# EAGLE design TaaraESP-THBL (EAGLE 7.7.0)
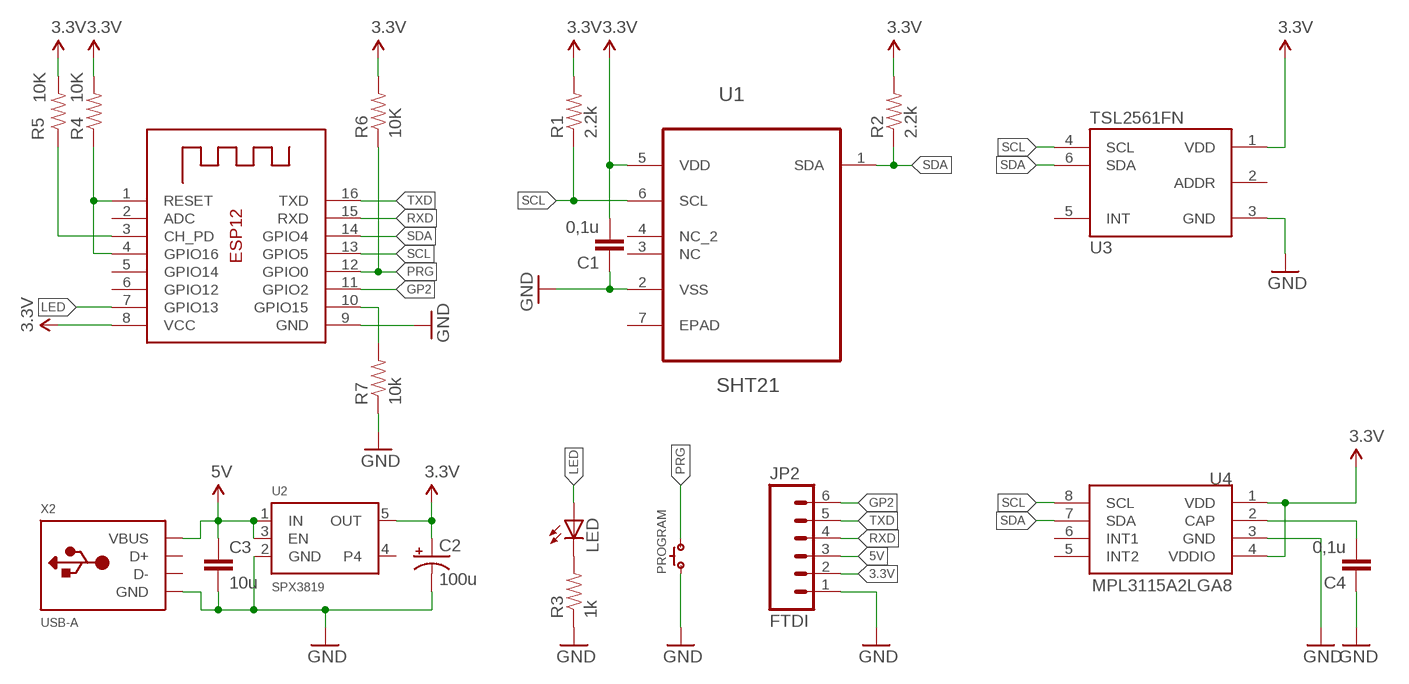
[diagram p0: schematic, sheet 1]

## Parts
C1  0,1u  CAP0603-CAP  [0603-CAP]
C2  100u  CAP_POL1206  [EIA3216]
C3  10u  CAP0603-CAP  [0603-CAP]
C4  0,1u  CAP0603-CAP  [0603-CAP]
JP2  FTDI  M06SIP_LOCK  [1X06-SIP_LOCK]
LED  LEDCHIPLED_0603  [CHIPLED_0603]
PROGRAM  SPST.B3U-1000P(M)-B  [B3U-1000P(M)-B]
R1  2.2k  RESISTOR0603-RES  [0603-RES]
R2  2.2k  RESISTOR0603-RES  [0603-RES]
R3  1k  RESISTOR0603-RES  [0603-RES]
R4  10K  RESISTOR0603-RES  [0603-RES]
R5  10K  RESISTOR0603-RES  [0603-RES]
R6  10K  RESISTOR0603-RES  [0603-RES]
R7  10k  RESISTOR0603-RES  [0603-RES]
U1  SHT21  [DFN300X300X110-7N]
U2  SPX3819  VREG_SOT23-5  [SOT23-5]
U3  TSL2561FN  [FN-6]
U4  MPL3115A2LGA8  [LGA8]
X1  ESP-12  [ESP-12]
X2  USB-A  [MOLEX_480371000]

## Nets
3.3V: C1.2 C2.A(+) JP2.2 R1.2 R2.2 R4.2 R5.2 R6.2 U1.5(VDD) U2.5(OUT) U3.1(VDD) U4.1(VDD) U4.4(VDDIO) X1.8(VCC)
5V: C3.1 JP2.3 U2.1(IN) U2.3(EN) X2.1(VBUS)
GND: C1.1 C2.C(-) C3.2 C4.1 JP2.1 PROGRAM.1 R3.1 R7.1 U1.2(VSS) U2.2(GND) U3.3(GND) U4.3(GND) X1.9(GND) X2.4(GND)
GP2: JP2.6 X1.11(GPIO2)
LED: LED.A X1.7(GPIO13)
N$1: LED.C R3.2
N$2: R4.1 X1.1(RESET) X1.4(GPIO16)
N$3: R5.1 X1.3(CH_PD)
N$4: R7.2 X1.10(GPIO15)
N$5: C4.2 U4.2(CAP)
PRG: PROGRAM.2 R6.1 X1.12(GPIO0)
RXD: JP2.4 X1.15(RXD)
SCL: R1.1 U1.6(SCL) U3.4(SCL) U4.8(SCL) X1.13(GPIO5)
SDA: R2.1 U1.1(SDA) U3.6(SDA) U4.7(SDA) X1.14(GPIO4)
TXD: JP2.5 X1.16(TXD)
Unconnected: U1.3(NC) U1.4(NC_2) U1.7(EPAD) U2.4 U3.2(ADDR) U3.5(INT) U4.5(INT2) U4.6(INT1) X1.2(ADC) X1.5(GPIO14) X1.6(GPIO12) X2.2(D-) X2.3(D+)

## Library data of the parts
C1 C3 C4 = SparkFun:CAP: Capacitor Standard 0603 ceramic capacitor, and 0.1" leaded capacitor.
C2 = SparkFun:CAP_POL: Capacitor Polarized These are standard SMD and PTH capacitors. Normally 10uF, 47uF, and 100uF in electrolytic and tantalum varieties. Always verify the external diameter of the through hole cap, it varies with capacity, voltage, and manufacturer. The EIA devices should be standard.
JP2 = SparkFun:M06: Header 6 Standard 6-pin 0.1" header. Use with straight break away headers (SKU : PRT-00116), right angle break away headers (PRT-00553), swiss pins (PRT-00743), machine pins (PRT-00117), and female headers (PRT-00115). Molex polarized connector foot print use with SKU : PRT-08094 with associated crimp pins and housings. NOTES ON THE VARIANTS LOCK and LOCK_LONGPADS... This footprint was designed to help hold the alignment of a through-hole component (i.e. 6-pin header) while soldering it into place. You may notice that each hole has been shifted either up or down by 0.005 of an inch from it's more standard position (which is a perfectly straight line). This slight alteration caused the pins (the squares in the middle) to touch the edges of the holes. Because they are alternating, it causes a "brace" to hold the component in place. 0.005 has proven to be the perfect amount of "off-center" position when using our standard breakaway headers. Although looks a little odd when you look at the bare footprint, once you have a header in there, the alteration is very hard to notice. Also, if you push a header all the way into place, it is covered up entirely on the bottom side. This idea of altering the position of holes to aid alignment will be further integrated into the Sparkfun Library for other footprints. It can help hold any component with 3 or more connection pins.
LED = adafruit:LED: LED OSRAM: - CHIPLED LG R971, LG N971, LY N971, LG Q971, LY Q971, LO R971, LY R971 LH N974, LH R974 LS Q976, LO Q976, LY Q976 LO Q996 - Hyper CHIPLED LW Q18S LB Q993, LB Q99A, LB R99A - SideLED LS A670, LO A670, LY A670, LG A670, LP A670 LB A673, LV A673, LT A673, LW A673 LH A674 LY A675 LS A676, LA A676, LO A676, LY A676, LW A676 LS A679, LY A679, LG A679 - Hyper Micro SIDELED® LS Y876, LA Y876, LO Y876, LY Y876 LT Y87S - SmartLED LW L88C, LW L88S LB L89C, LB L89S, LG L890 LS L89K, LO L89K, LY L89K LS L896, LA L896, LO L896, LY L896 - TOPLED LS T670, LO T670, LY T670, LG T670, LP T670 LSG T670, LSP T670, LSY T670, LOP T670, LYG T670 LG T671, LOG T671, LSG T671 LB T673, LV T673, LT T673, LW T673 LH T674 LS T676, LA T676, LO T676, LY T676, LB T676, LH T676, LSB T676, LW T676 LB T67C, LV T67C, LT T67C, LS T67K, LO T67K, LY T67K, LW E67C LS E67B, LA E67B, LO E67B, LY E67B, LB E67C, LV E67C, LT E67C LW T67C LS T679, LY T679, LG T679 LS T770, LO T770, LY T770, LG T770, LP T770 LB T773, LV T773, LT T773, LW T773 LH T774 LS E675, LA E675, LY E675, LS T675 LS T776, LA T776, LO T776, LY T776, LB T776 LHGB T686 LT T68C, LB T68C - Hyper Mini TOPLED® LB M676 - Mini TOPLED Santana® LG M470 LS M47K, LO M47K, LY M47K Source: http://www.osram.convergy.de/
PROGRAM = omron:SPST
R1-R7 = SparkFun:RESISTOR: Resistor Basic schematic elements and footprints for 0603, 1206, and PTH resistors.
U1 = Sensirion-SHT21:SHT21: SENSOR, HUMIDITY & TEMP; MPN: SHT21; OC_FARNELL: 1855468; OC_NEWARK: 20T1172; PACKAGE: DFN-6; SUPPLIER: SENSIRION
U2 = microbuilder:VREG_SOT23-5: SOT23-5 Fixed Voltage Regulators Part Current Out V Out V In V Dropout θJA (°C/W) TJ (°C) Digikey Part No. ADP121 150mA 3.3V 3.4-5.5V 0.09V @ 150mA -- -- ADP121-AUJZ33R7CT-ND ADP121 150mA 3.0V 3.1-5.5V 0.09V @ 150mA -- -- ADP121-AUJZ30R7CT-ND ADP122 300mA 3.3V 3.4-5.5V 0.085V @ 300mA -- -- ADP122AUJZ-3.3-R7CT-ND ADP1712 300mA 3.3V 3.5-5.5V 0.17V @ 300mA -- -- ADP1712AUJZ-3.3-R7TR-ND AP7311 (Low Cost) 150mA 3.3V 3.5-6V 0.15V @ 150mA -- -- AP7311-33WG-7DICT-ND LD39015M18R 150mA 1.8V 1.9V-5.5V 0.08V @ 100mA -- -- 497-6977-1-ND LP2985A-33DBVR 150mA 3.3V 3.3-16V 0.28V @ 150mA 206 150 296-18479-1-ND MCP1824T-3302E/OT 300mA 3.3V 3.5V-6V 0.2V @ 300mA -- -- MCP1824T-3302E/OTCT-ND MIC5205-2.5YM5 TR 150mA 2.5V 2.7-16V 0.165V @ 150mA -- -- 576-1257-2-ND MIC5205-3.0YM5 TR 150mA 3.0V 3.2V-16V 0.165V @ 150mA -- -- 576-1258-2-ND MIC5205-3.3YM5 TR 150mA 3.3V 3.5V-16V 0.165V @ 150mA -- -- 576-1259-2-ND TPS780330220 150mA 3.3V+2.2V 3.6-5.5V 250mV Max -- -- 296-23332-1-ND TDA3663/N1,135 100mA 3.3V 3.5-45V 0.18V @ 50mA -- -- 568-5343-1-ND Max operating temp can be calculated using θJA, TJ (max junction temperature), and power in watts. Set the "Maximum Ambient Temperature" until it reaches TJ ("Max Junction Temperature"), which is the absolute limit for safe use of the regulator: Heat Sink Temperature Calculator <http://www.daycounter.com/Calculators/Heat-Sink-Temperature-Calculator.phtml> For example, With 12V source into a 3.3V LP2985 and a 30mA load, we are dissipating (12V-3.3V) * 0.03A = 0.261W. With a θJA of 206 °C/W, a TJ of 150°C, and 261mW we can safely use the chip without a heat sink up to 75°C (=147.1°C Junction Temperature).
U3 = mike-temp:TSL2561: TSL2561 illumination sensor Approximates Human Eye Response Precisely Measures Illuminance Programmable Interrupt Function with User-Defined Upper and Lower Threshold 400 KHz I2C interface Programmable Analog Gain and Integration Time Supporting 1,000,000-to-1 Dynamic Range Automatically Rejects 50/60-Hz Lighting Ripple Low Active Power (0.75 mW Typical) with Power Down Mode RoHS Compliant The TSL2561 is a light-to-digital converter that transform light intensity to a digital signal output via I2C interface. The device combines one broadband photodiode (visible plus infrared) and one infrared-responding photodiode on a single CMOS integrated circuit capable of providing a near-photopic response over an effective 20-bit dynamic range (16-bit resolution). Two integrating ADCs convert the photodiode currents to a digital output that represents the irradiance measured on each channel. This digital output can be input to a microprocessor where illuminance (ambient light level) in lux is derived using an empirical formula to approximate the human eye response. The TSL2561 device supports a traditional level style interrupt that remains asserted until the firmware clears it.
U4 = SparkFun-Sensors:MPL3115A2: Altimeter/Pressure Sensor, I2C, 1.95V-3.6V supply, 50 to 110kPa
X1 = microbuilder:ESP-12
X2 = adafruit:USB-A: USB type A 'plug' Used for things that can directly connect to a USB port, say USB key

## Net classes
0 default: width 0.2 mm
1 power: width 0.2 mm

## Board
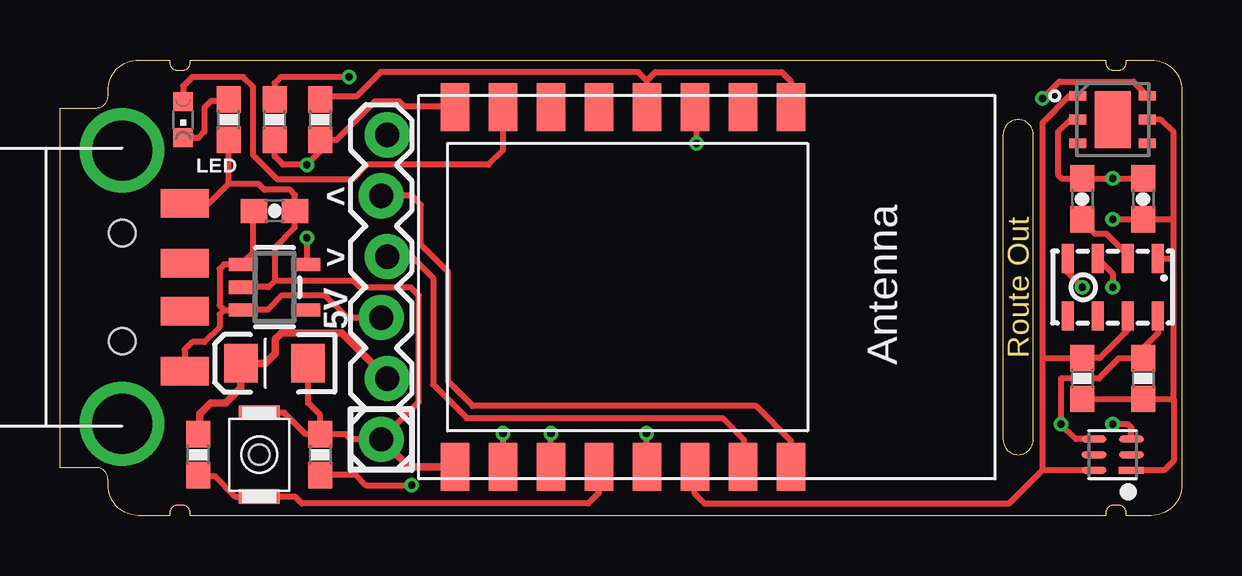
[diagram p1: board, top side]
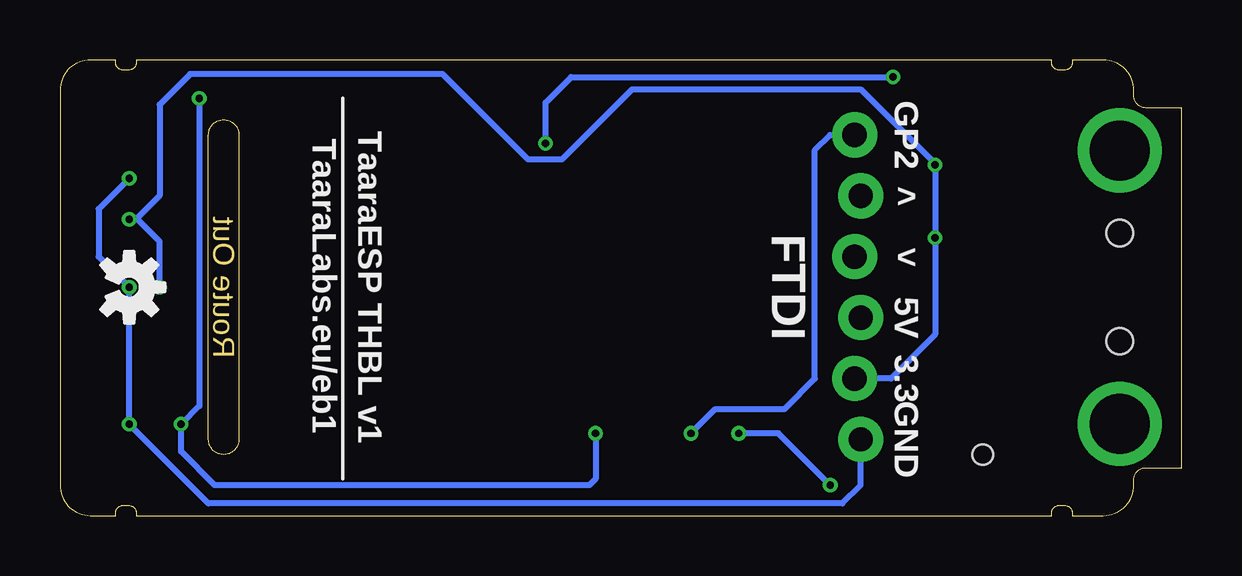
[diagram p2: board, bottom side, seen from below]

Size 46.75 x 19 mm. Coordinates in mm from the lower left corner, seen from the top.
Outline: 39.29,15.88 39.29,3.17 arc90 39.93,2.54 arc90 40.56,3.17 40.56,15.88 arc90 39.93,16.51 arc90 39.29,15.88
Outline: 4.57,0 3.27,0 arc-90 2,1.27 2,1.5 arc90 1.5,2 0,2 0,17 1.5,17 arc90 2,17.5 2,17.73 arc-90 3.27,19 4.57,19 4.57,18.89 arc90 4.89,18.57 5.11,18.57 arc90 5.43,18.89 5.43,19 43.57,19 43.57,18.89 arc90 43.89,18.57 44.11,18.57 arc90 44.43,18.89 44.43,19 45.48,19 arc-90 46.75,17.73 46.75,1.27 arc-90 45.48,0 44.43,0 44.43,0.11 arc90 44.11,0.43 43.89,0.43 arc90 43.57,0.11 43.57,0 5.43,0 5.43,0.11 arc90 5.11,0.43 4.89,0.43 arc90 4.57,0.11 4.57,0
Copper layers (1*16): Top 0.035mm / dielectric 1.5mm / Bottom 0.035mm
Design rules "default *": minimum track width 10mil, minimum drill 12mil, track to track 6mil, track to pad 6mil, pad to pad 6mil, via to via 6mil, smd to smd 0mil, copper to edge 10mil, drill to drill 10mil, minimum pad ring 10mil, minimum via ring 6mil, stop-mask expansion 2mil, vias tented up to drill 100mil, thermal gap 10mil

### Footprints (pad centres in the part's own frame; a part is rotated, then mirrored left to right if it is on the bottom)
0603-CAP = smd 1.1 x 1: 1 -0.85,0; 2 0.85,0
EIA3216 = smd 1.4 x 1.6: A 1.4,0; C -1.4,0
1X06-SIP_LOCK = drill 1.016 pad 1.88: 1 0,0; 2 2.54,-0.254; 3 5.08,0; 4 7.62,-0.254; 5 10.16,0; 6 12.7,-0.254
CHIPLED_0603 = smd 0.8 x 0.8: A 0,-0.75; C 0,0.75
B3U-1000P(M)-B = smd 0.6 x 1.7: 1 -1.75,0; 2 1.75,0 | hole 0.85: 0,0
0603-RES = smd 1.1 x 1: 1 -0.85,0; 2 0.85,0
DFN300X300X110-7N = smd 0.711 x 0.406: 1 -1.448,0.991; 2 -1.448,0; 3 -1.448,-0.991; 4 1.448,-0.991; 5 1.448,0; 6 1.448,0.991 | smd 1.499 x 2.388: 7 0,0
SOT23-5 = smd 0.55 x 1.2: 1 -0.95,-1.3; 2 0,-1.3; 3 0.95,-1.3; 4 0.95,1.3; 5 -0.95,1.3
FN-6 = smd 1.05 x 0.3: 1 -0.775,0.65; 2 -0.775,0; 3 -0.775,-0.65; 4 0.775,-0.65; 5 0.775,0; 6 0.775,0.65
LGA8 = smd 1.2 x 0.5: 1 -1.2,1.875; 2 -1.2,0.625; 3 -1.2,-0.625; 4 -1.2,-1.875; 5 1.2,-1.875; 6 1.2,-0.625; 7 1.2,0.625; 8 1.2,1.875
ESP-12 = smd 2 x 1.2: 1 -7.5,4.5; 2 -7.5,2.5; 3 -7.5,0.5; 4 -7.5,-1.5; 5 -7.5,-3.5; 6 -7.5,-5.5; 7 -7.5,-7.5; 8 -7.5,-9.5; 9 7.5,-9.5; 10 7.5,-7.5; 11 7.5,-5.5; 12 7.5,-3.5; 13 7.5,-1.5; 14 7.5,0.5; 15 7.5,2.5; 16 7.5,4.5
MOLEX_480371000 = smd 1.2 x 2: 1 3.5,2.6; 2 1,2.6; 3 -1,2.6; 4 -3.5,2.6 | drill 2.5: M1 -5.7,0; M2 5.7,0 | hole 1.1: -2.25,0; 2.25,0

### Placement (x,y rotation side)
C1  45.13,13.21 270 top
C2  8.94,6.35 180 top
C3  8.94,12.7 0 top
C4  42.59,13.21 270 top
JP2  13.38,3.17 90 top
LED  5.13,16.51 180 top
PROGRAM  8.3,2.54 270 top
R1  45.13,5.71 270 top
R2  42.59,5.71 270 top
R3  7.03,16.51 90 top
R4  10.84,16.51 270 top
R5  8.94,16.51 270 top
R6  5.76,2.54 90 top
R7  10.84,2.54 270 top
U1  43.86,16.51 0 top
U2  8.94,9.53 270 top
U3  43.86,2.54 180 top
U4  43.86,9.53 270 top
U$5  [OSHW-LOGO-S]  43.86,9.53 270 bottom
X1  25.96,9.53 270 top
X2  2.59,9.53 270 top

### Tracks (layer width: path | path; a pad name or v marks a point on that pad's centre or on a via)
3.3V  (via drill 0.3)
  Top 0.254: 10.69,15.85 R4.2 | v10.28,11.58 10.28,10.57 U2.5 | X1.8 16.43,17.07 14.35,17.07 14.14,17.27 13.13,17.27 11.52,15.66 R4.2 | 5.81,3.45 R6.2 | R4.2 10.84,15.19 v10.28,14.63 9.29,14.63 8.94,14.99 R5.2 | 45.67,10.79 U4.1 46.4,10.72 | 44.72,1.91 U3.1 46.01,1.89 46.4,2.29 46.4,4.87 | 46.4,4.87 R1.2 R2.2 | 46.4,4.87 46.4,10.72 | 46.4,10.72 46.4,12.36 | 46.4,12.36 46.4,16 45.89,16.51 U1.5 | 46.4,12.36 C1.2 v43.86,12.36 | U4.4 41.99,10.13 v42.59,9.53
  Top 0.305: 5.81,3.45 5.81,4.24 6.27,4.7 6.91,4.7 7.54,5.33 C2.A 8.56,6.35 8.98,6.77 8.98,7.37 9.23,7.62 11.73,7.62 JP2.2
  Bottom 0.254: JP2.2 12.11,5.71 10.28,7.54 v10.28,11.58 v10.28,14.63 10.28,14.68 13.38,17.78 22.91,17.78 25.83,14.86 27.25,14.86 30.81,18.41 41.32,18.41 42.59,17.14 42.59,13.34 43.57,12.36 v43.86,12.36 43.52,12.36 42.59,11.43 v42.59,9.53
5V
  Top 0.254: C3.1 8.05,12.6 8.05,10.97 7.64,10.57 U2.1 6.84,10.47 6.65,10.29 6.65,8.76 6.84,8.57 | 5,6.1 X2.1 5.19,6.92 5.51,7.24 6.02,7.24 6.65,7.87 6.65,8.39 6.84,8.57 | 7.64,8.53 U2.3 | JP2.3 11.96,8.26 11.02,9.2 9.27,9.2 8.65,8.57 U2.3 | 6.84,8.57 U2.3
GND  (via drill 0.3)
  Top 0.254: 7.03,15.44 R3.1 7.03,13.84 | 16.63,2.03 X1.9 16.43,2.03 | X2.4 6.22,13.03 7.03,13.84 | 7.03,13.84 8.26,13.84 8.52,13.59 9.57,13.59 9.79,13.37 C3.2 9.79,12.03 8.94,11.18 8.94,9.78 | R7.1 11.9,3.39 12.11,3.17 JP2.1 14.96,4.75 14.96,9.17 14.6,9.53 12.49,9.53 12.24,9.78 8.94,9.78 | R7.1 10.84,4.19 10.34,4.7 C2.C | R7.1 10.25,3.39 9.35,4.29 PROGRAM.1 | 8.94,9.78 8.68,9.53 U2.2 | U3.3 44.64,3.67 44.5,3.81 v43.86,3.81 | U4.3 43.86,10.1 v43.86,9.53 | U1.2 42.09,16.51 41.58,16 41.58,14.22 41.74,14.06 C4.1 42.66,14.13 42.73,14.06 v43.86,14.06 C1.1
  Top 0.305: X1.9 14.53,2.02 JP2.1
  Bottom 0.254: JP2.1 13.38,1.27 14.14,0.51 40.56,0.51 v43.86,3.81 v43.86,9.53 45.13,10.79 45.13,12.79 v43.86,14.06
GP2  (via drill 0.3)
  Top 0.254: X1.11 v20.46,3.43
  Bottom 0.254: JP2.6 14.65,15.88 15.29,15.24 15.29,5.71 16.56,4.45 19.44,4.45 v20.46,3.43
LED
  Top 0.254: LED.A 5.13,17.91 5.51,18.29 7.64,18.29 8.05,17.88 8.05,15.04 9.07,14.02 12.19,14.02 12.8,14.63 17.85,14.63 18.46,15.24 X1.7
N$1
  Top 0.254: R3.2 7.03,17.27 6.27,17.27 6.02,17.02 6.02,16 5.76,15.75 5.14,15.75 LED.C
N$2
  Top 0.254: R4.1 10.89,17.48 12.34,17.48 13.36,18.49 24.1,18.49 24.46,18.14 | 30.45,17.07 X1.1 30.46,18.11 30.07,18.49 24.81,18.49 24.46,18.14 | 24.46,18.14 X1.4
N$3  (via drill 0.3)
  Top 0.254: v12.04,18.29 9.19,18.29 8.94,18.03 R5.1 | X1.3 26.52,16.97 v26.52,15.52
  Bottom 0.254: v12.04,18.29 25.45,18.29 26.52,17.22 v26.52,15.52
N$4  (via drill 0.3)
  Top 0.254: 18.34,1.91 X1.10 v18.46,3.42 v18.46,3.43 | R7.2 12.33,1.69 12.75,1.27 v14.65,1.27
  Bottom 0.254: v14.65,1.27 16.81,3.43 v18.46,3.43
N$5
  Top 0.254: C4.2 42.66,12.22 43.13,11.75 43.61,11.75 44.56,10.79 U4.2
PRG
  Top 0.254: R6.1 5.81,1.63 6.47,1.63 7.31,0.79 PROGRAM.2 9.8,0.79 10.08,0.51 22.02,0.51 22.46,0.94 X1.12
RXD
  Top 0.254: 28.42,2.03 X1.15 28.5,2.06 28.5,3.17 27.61,4.06 16.94,4.06 15.54,5.46 15.54,9.91 14.65,10.79 JP2.4
SCL  (via drill 0.3)
  Top 0.254: v24.43,3.43 24.43,2.05 X1.13 | U1.6 45.2,17.62 44.72,18.1 41.64,18.1 v40.94,17.4 | U4.8 45.77,8.29 45.77,7.62 45.13,6.99 R1.1 44.14,6.57 43.29,5.71 41.7,5.71 v41.7,3.81 42.32,3.19 U3.4
  Bottom 0.254: v24.43,3.43 24.43,1.52 24.69,1.27 40.31,1.27 41.7,2.67 v41.7,3.81 40.94,4.57 v40.94,17.4
SDA
  Top 0.254: X1.14 26.46,0.9 26.85,0.51 39.54,0.51 40.92,1.89 | 40.94,6.57 40.94,1.91 40.92,1.89 | 40.94,6.57 40.94,16.38 42.06,17.5 U1.1 | U3.6 40.92,1.89 | U4.7 44.49,7.74 43.32,6.57 R2.1 40.94,6.57
TXD
  Top 0.254: X1.16 30.46,3.12 29,4.57 17.19,4.57 16.18,5.59 16.18,10.16 15.03,11.3 15.03,12.95 14.65,13.34 JP2.5

### Text on the board
Dimension: Route Out
tNames: < | > | 5V
bNames: GP2 | > | < | FTDI | 5V | 3.3 | GND
tValues: 2x0.1 | 2x2.2k
_bsilk: TaaraESP THBL v1 | TaaraLabs.eu/eb1